# EAGLE design Qwiic Module for Tessel 2 (EAGLE 7.7.0)
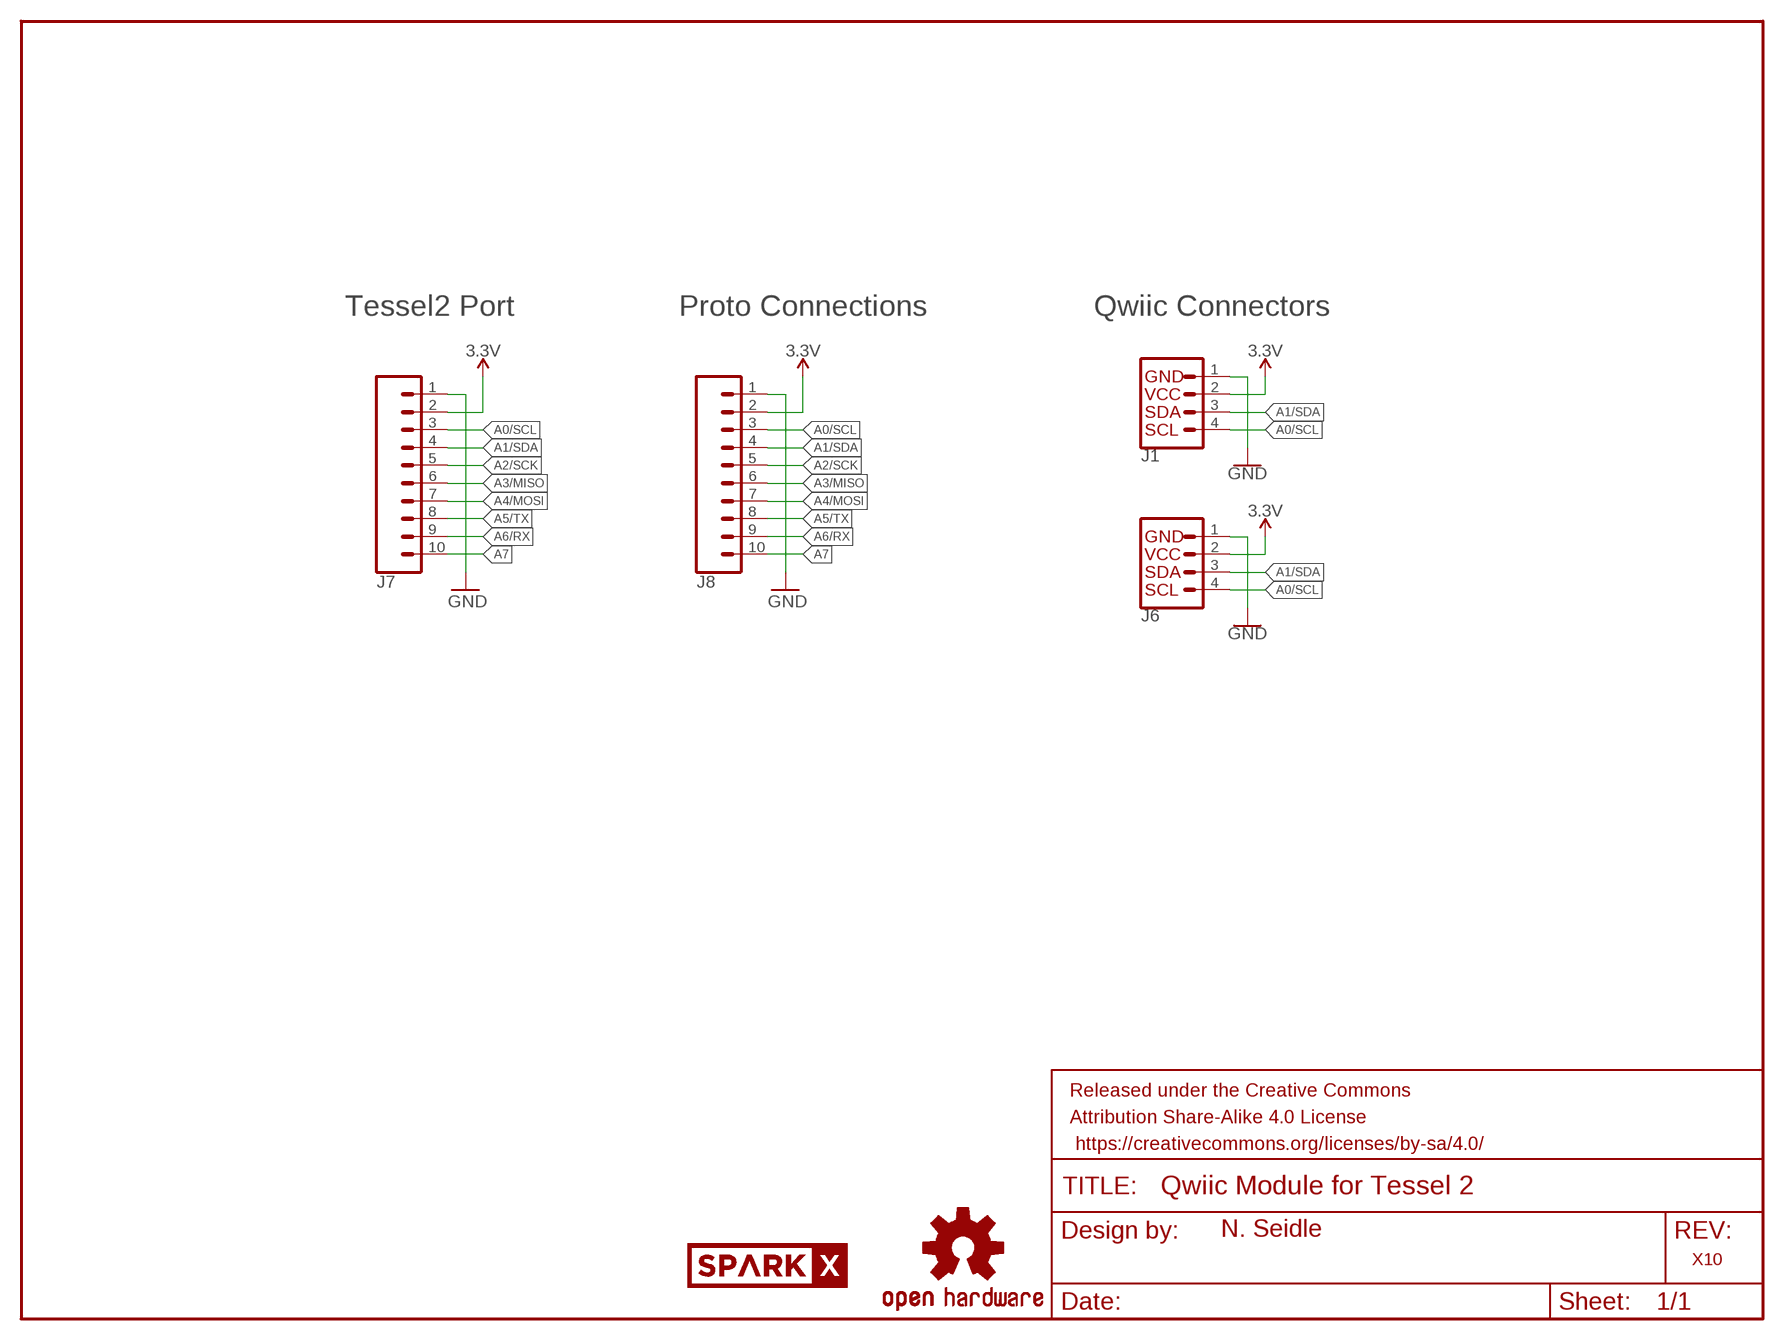
[diagram p0: schematic, sheet 1]

## Parts
FRAME1  FRAME-LETTER  [CREATIVE_COMMONS]
J1  I2C_STANDARDJS-1MM  [1X04_1MM_RA]
J6  I2C_STANDARDJS-1MM  [1X04_1MM_RA]
J7  CONN_10NO_SILK_PTH_FEMALE  [1X10_NO_SILK]
J8  CONN_10NO_SILK_PTH_FEMALE  [1X10_NO_SILK]
LOGO1  OSHW-LOGOMINI  [OSHW-LOGO-MINI]
U$2  SPARKX-LOGO4  [SPARKX-MEDIUM]

## Nets
3.3V: J1.2(VCC) J6.2(VCC) J7.2 J8.2
A0/SCL: J1.4(SCL) J6.4(SCL) J7.3 J8.3
A1/SDA: J1.3(SDA) J6.3(SDA) J7.4 J8.4
A2/SCK: J7.5 J8.5
A3/MISO: J7.6 J8.6
A4/MOSI: J7.7 J8.7
A5/TX: J7.8 J8.8
A6/RX: J7.9 J8.9
A7: J7.10 J8.10
GND [vcc]: J1.1(GND) J6.1(GND) J7.1 J8.1

## Notes on the sheet
- Tessel2 Port | Proto Connections | Qwiic Connectors
- N. Seidle
- X10

## Library data of the parts
FRAME1 = SparkFun-Aesthetics:FRAME-LETTER: Schematic Frame Standard 8.5x11 US Letter frame
J1 J6 = SparkX:I2C_STANDARD: SparkFun I2C Standard Pinout Header SparkFun has standardized on a pinout for all I2C based sensor breakouts. This pinout allows I2C boards to be plugged directly into the headers on Arduino Uno compatible boards, and to be daisy chained easily. Example SparkFun Products: SparkFun Atmospheric Sensor Breakout - BME280 <https://www.sparkfun.com/products/13676> SparkFun Altitude/Pressure Sensor Breakout - MPL3115A2 <https://www.sparkfun.com/products/11084> SparkFun TOF Range Finder Sensor - VL6180 <https://www.sparkfun.com/products/12785>
J7 J8 = SparkFun-Connectors:CONN_10: Multi connection point. Often used as Generic Header-pin footprint for 0.1 inch spaced/style header connections On any of the 0.1 inch spaced packages, you can populate with these: Break Away Headers - Straight <https://www.sparkfun.com/products/116> (PRT-00116) Break Away Male Headers - Right Angle <https://www.sparkfun.com/products/553> (PRT-00553) Female Headers <https://www.sparkfun.com/products/115> (PRT-00115) Break Away Headers - Machine Pin <https://www.sparkfun.com/products/117> (PRT-00117) Break Away Female Headers - Swiss Machine Pin <https://www.sparkfun.com/products/743> (PRT-00743) Arduino Stackable Header - 10 Pin <https://www.sparkfun.com/products/11376> (PRT-11376) For SCREWTERMINALS and SPRING TERMINALS visit here: Screw Terimnals on SparkFun.com <https://www.sparkfun.com/search/results?term=Screw+Terminals> (5mm/3.5mm/2.54mm spacing) This device is also useful as a general connection point to wire up your design to another part of your project. Our various solder wires solder well into these plated through hole pads. Hook-Up Wire - Assortment (Stranded, 22 AWG) <https://www.sparkfun.com/products/11375> (PRT-11375) Hook-Up Wire - Assortment (Solid Core, 22 AWG) <https://www.sparkfun.com/products/11367> (PRT-11367) View the entire wire category on our website here <https://www.sparkfun.com/categories/141> Special notes: Molex polarized connector foot print use with SKU : PRT-08231 with associated crimp pins and housings. 1MM SMD Version SKU: PRT-10208 NOTES ON THE VARIANTS LOCK and LOCK_LONGPADS... This footprint was designed to help hold the alignment of a through-hole component (i.e. 6-pin header) while soldering it into place. You may notice that each hole has been shifted either up or down by 0.005 of an inch from it's more standard position (which is a perfectly straight line). This slight alteration caused the pins (the squares in the middle) to touch the edges of the holes. Because they are alternating, it causes a "brace" to hold the component in place. 0.005 has proven to be the perfect amount of "off-center" position when using our standard breakaway headers. Although looks a little odd when you look at the bare footprint, once you have a header in there, the alteration is very hard to notice. Also,if you push a header all the way into place, it is covered up entirely on the bottom side.; PROD_ID: CONN-11563
LOGO1 = SparkFun-Aesthetics:OSHW-LOGO: Open Source Hardware Logo This logo indicates the piece of hardware it is found on incorporates a OSHW license and/or adheres to the definition of open source hardware found here: http://freedomdefined.org/OSHW
U$2 = SparkX:SPARKX-LOGO

## Net classes
0 Default: width 0.178 mm
1 vcc: width 0.178 mm

## Board
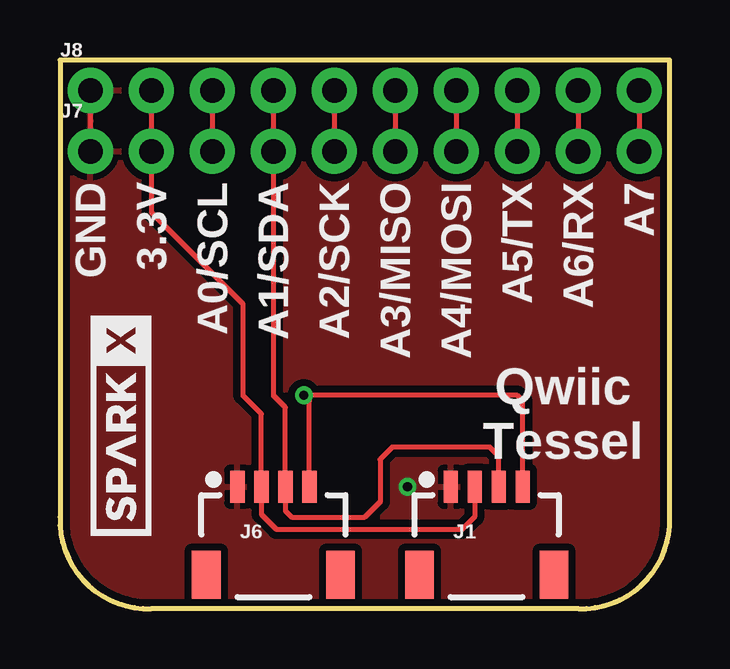
[diagram p1: board, top side]
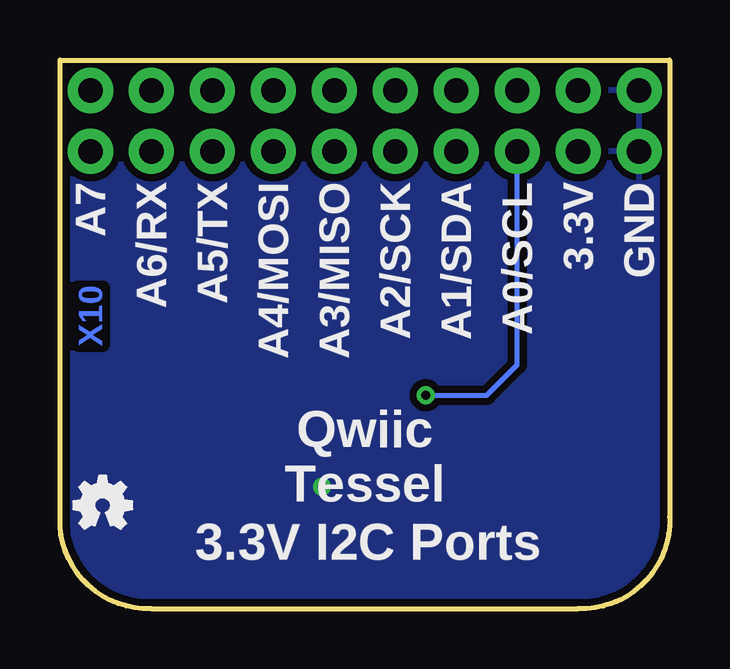
[diagram p2: board, bottom side, seen from below]

Size 25.4 x 22.86 mm. Coordinates in mm from the lower left corner, seen from the top.
Outline: 0,22.86 0,3.81 arc94 3.81,0 21.59,0 arc94 25.4,3.81 25.4,22.86 0,22.86
Copper layers (1*16): Top 0.035mm / dielectric 1.5mm / Bottom 0.035mm
Design rules "SparkFun-2-layer-TIGHT *": minimum track width 7mil, minimum drill 15mil, track to track 6mil, track to pad 6mil, pad to pad 6mil, via to via 6mil, smd to smd 6mil, copper to edge 7mil, drill to drill 7mil, minimum pad ring 7mil, minimum via ring 7mil, stop-mask expansion 4mil, vias tented up to drill 25mil, thermal gap 10mil

### Footprints (pad centres in the part's own frame; a part is rotated, then mirrored left to right if it is on the bottom)
1X04_1MM_RA = smd 0.6 x 1.35: 1 -1.5,0; 2 -0.5,0; 3 0.5,0; 4 1.5,0 | smd 1.2 x 2: NC1 2.8,-3.675; NC2 -2.8,-3.675
1X10_NO_SILK = drill 1.016 pad 1.88: 1 0,0; 2 2.54,0; 3 5.08,0; 4 7.62,0; 5 10.16,0; 6 12.7,0; 7 15.24,0; 8 17.78,0; 9 20.32,0; 10 22.86,0

### Placement (x,y rotation side)
FRAME1  -8.89,-24.13 0 top  (outside the outline)
J1  17.78,5.08 0 top
J6  8.89,5.08 0 top
J7  1.27,19.05 0 top
J8  1.27,21.59 0 top
LOGO1  23.62,4.32 0 bottom
U$2  2.54,7.62 90 top

### Tracks (layer width: path | path; a pad name or v marks a point on that pad's centre or on a via)
3.3V
  Top 0.203: J8.2 J7.2 3.81,16.51 7.62,12.7 7.62,8.89 8.39,8.12 J6.2 8.39,3.93 9.02,3.3 16.76,3.3 17.28,3.82 J1.2
A0/SCL  (via drill 0.38)
  Top 0.203: J8.3 J7.3 | J6.4 10.39,8.66 v10.16,8.89 19.05,8.89 19.28,8.66 J1.4
  Bottom 0.203: v10.16,8.89 7.62,8.89 6.35,10.16 J7.3
A1/SDA
  Top 0.203: J8.4 J7.4 8.89,8.89 9.39,8.39 J6.3 9.39,4.07 9.65,3.81 12.7,3.81 13.34,4.45 13.34,6.22 13.84,6.73 17.91,6.73 18.28,6.36 J1.3
A2/SCK
  Top 0.203: J8.5 J7.5
A3/MISO
  Top 0.203: J8.6 J7.6
A4/MOSI
  Top 0.203: J8.7 J7.7
A5/TX
  Top 0.203: J8.8 J7.8
A6/RX
  Top 0.203: J8.9 J7.9
A7
  Top 0.203: J8.10 J7.10
GND  (via drill 0.38)
  Top 0.203: J8.1 J7.1
  other vias: 14.48,5.08
  pour Top (isolate 0.305): 0,22.86 25.4,22.86 25.4,0 0,0
  pour Bottom (isolate 0.305): 0,22.86 25.4,22.86 25.4,0 0,0

### Text on the board
Bottom: X10
tPlace: GND | 3.3V | A0/SCL | A1/SDA | A2/SCK | A3/MISO | A4/MOSI | A5/TX | A6/RX | A7 | Qwiic / Tessel
bPlace: GND | 3.3V | A0/SCL | A1/SDA | A2/SCK | A3/MISO | A4/MOSI | A5/TX | A6/RX | A7 | Qwiic / Tessel | 3.3V I2C Ports
tDocu: N. Seidle